# EAGLE design zook (EAGLE 7.2.0)
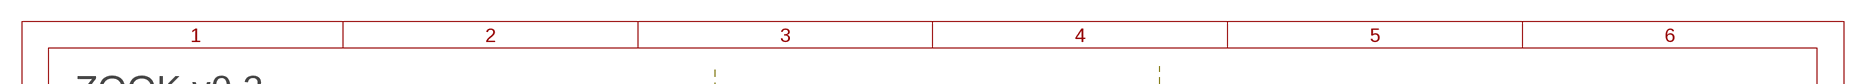
[diagram p0: schematic, sheet 1, part 1 of 2]
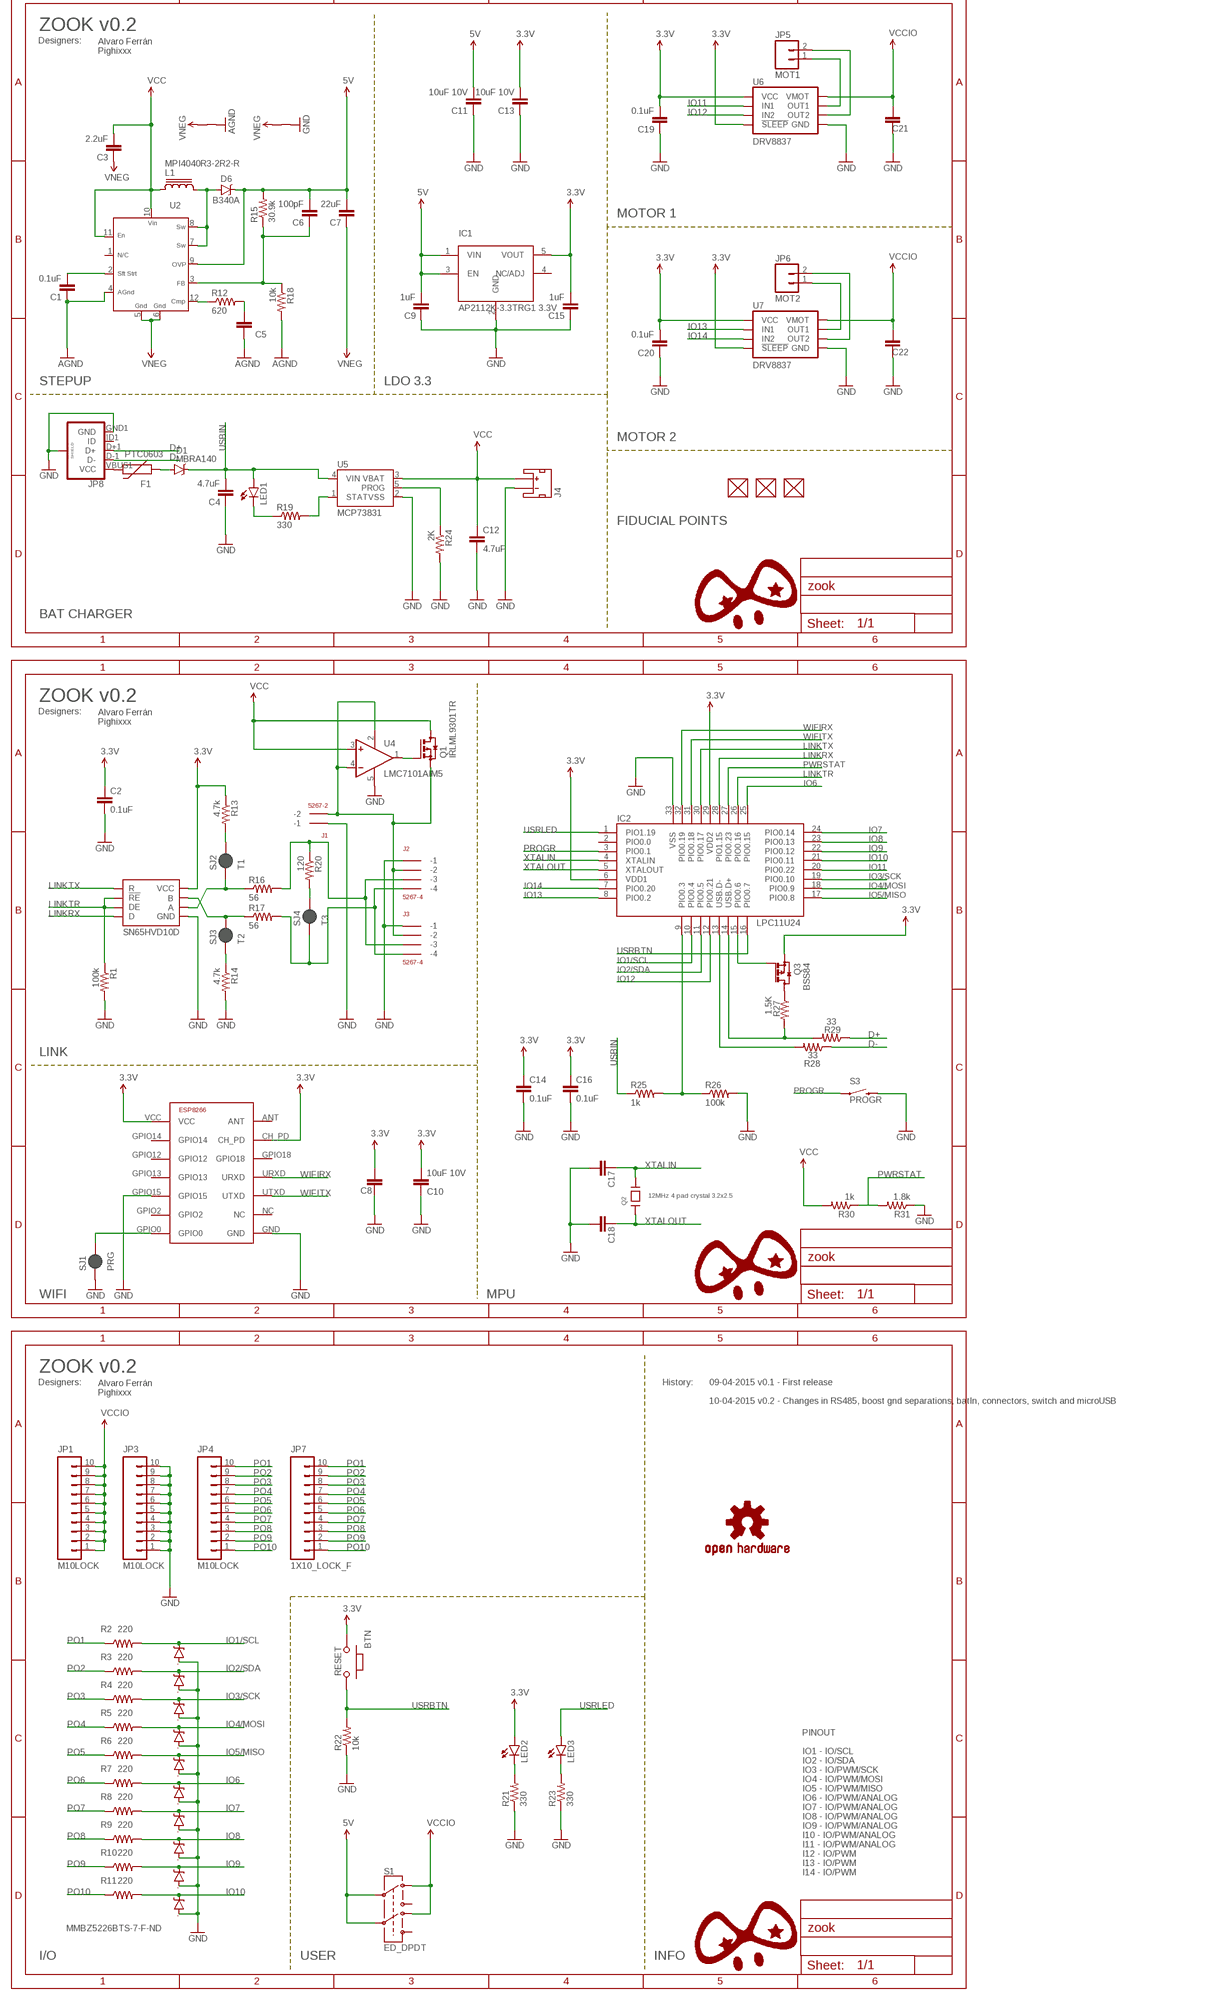
[diagram p1: schematic, sheet 1, part 2 of 2]

## Parts
BTN  RESET  PB157  [157SW]
C1  0.1uF  CAP0402-CAP  [0402-CAP]
C2  0.1uF  CAP0402-CAP  [0402-CAP]
C3  2.2uF  CAP0402-CAP  [0402-CAP]
C4  4.7uF  CAP0402-CAP  [0402-CAP]
C5  10nF  CAP0402-CAP  [0402-CAP]
C6  100pF  CAP0402-CAP  [0402-CAP]
C7  22uF  22UF-6.3V-20%(0805)  [0805]
C8  0.1uF  CAP0402-CAP  [0402-CAP]
C9  1uF  CAP0402-CAP  [0402-CAP]
C10  10uF 10V  CAP0402-CAP  [0402-CAP]
C11  10uF 10V  CAP0402-CAP  [0402-CAP]
C12  4.7uF  CAP0402-CAP  [0402-CAP]
C13  10uF 10V  CAP0402-CAP  [0402-CAP]
C14  0.1uF  CAP0402-CAP  [0402-CAP]
C15  1uF  CAP0402-CAP  [0402-CAP]
C16  0.1uF  CAP0402-CAP  [0402-CAP]
C17  27pF  CAP0402-CAP  [0402-CAP]
C18  27pF  CAP0402-CAP  [0402-CAP]
C19  0.1uF  CAP0402-CAP  [0402-CAP]
C20  0.1uF  CAP0402-CAP  [0402-CAP]
C21  0.1uF  CAP0402-CAP  [0402-CAP]
C22  0.1uF  CAP0402-CAP  [0402-CAP]
D1  MBRA140  [SMA-DIODE]
D2  ZENERARRAY  [SOT363]
D3  ZENERARRAY  [SOT363]
D4  ZENERARRAY  [SOT363]
D5  ZENERARRAY  [SOT363]
D6  B340A  DIODE-SCHOTTKY-B340A  [SMA-DIODE]
F1  PTC0603  [0603]
FUD1  FIDUCIAL  [FIDUCIAL_40MIL]
FUD2  FIDUCIAL  [FIDUCIAL_40MIL]
FUD3  FIDUCIAL  [FIDUCIAL_40MIL]
GND5  VIRTUAL_GND  [STARGND]
GND6  VIRTUAL_GND  [STARGND]
IC1  AP2112K-3.3TRG1 3.3V  5PIN_REG  [SOT23-5]
IC2  LPC11U24  LPC11U2X_HVQFN33(5X5)  [HVQFN33_5X5MM]
J1  5267-2  [5267-2]
J2  5267-4  [5267-4]
J3  5267-4  [5267-4]
J4  BATT  JST_2MM_MALE  [JST-2-SMD]
JP1  M10LOCK  [1X10_LOCK]
JP3  M10LOCK  [1X10_LOCK]
JP4  M10LOCK  [1X10_LOCK]
JP5  MOT1  M02POLAR  [MOLEX-1X2]
JP6  MOT2  M02POLAR  [MOLEX-1X2]
JP7  1X10_LOCK_F  [1X10_LOCK_F]
JP8  USB_MICROB_PLUGCONN-11752  [USB-B-MICRO-SMD_V03]
L1  MPI4040R3-2R2-R  [MPI4040R3-2R2-R]
LED1  LED0603  [LED-0603]
LED2  LED0603  [LED-0603]
LED3  LED0603  [LED-0603]
LOGO3  OSHW-LOGOS  [OSHW-LOGO-S]
Q1  IRLML9301TR  BSS84  [SOT23]
Q2  12MHz 4 pad crystal 3.2x2.5  CRYSTAL3.2X2.5  [CRYSTAL_3.2X2.5]
Q3  BSS84  [SOT23]
R1  100k  RESISTOR0402-RES  [0402-RES]
R2  220  220KOHM1/10W1%(0603)  [0603-RES]
R3  220  220KOHM1/10W1%(0603)  [0603-RES]
R4  220  220KOHM1/10W1%(0603)  [0603-RES]
R5  220  220KOHM1/10W1%(0603)  [0603-RES]
R6  220  220KOHM1/10W1%(0603)  [0603-RES]
R7  220  220KOHM1/10W1%(0603)  [0603-RES]
R8  220  220KOHM1/10W1%(0603)  [0603-RES]
R9  220  220KOHM1/10W1%(0603)  [0603-RES]
R10  220  220KOHM1/10W1%(0603)  [0603-RES]
R11  220  220KOHM1/10W1%(0603)  [0603-RES]
R12  620  RESISTOR0402-RES  [0402-RES]
R13  4.7k  RESISTOR0402-RES  [0402-RES]
R14  4.7k  RESISTOR0402-RES  [0402-RES]
R15  30.9k  RESISTOR0402-RES  [0402-RES]
R16  56  RESISTOR0402-RES  [0402-RES]
R17  56  RESISTOR0402-RES  [0402-RES]
R18  10k  RESISTOR0402-RES  [0402-RES]
R19  330  RESISTOR0402-RES  [0402-RES]
R20  120  RESISTOR0402-RES  [0402-RES]
R21  330  RESISTOR0402-RES  [0402-RES]
R22  10k  RESISTOR0402-RES  [0402-RES]
R23  330  RESISTOR0402-RES  [0402-RES]
R24  2K  RESISTOR0402-RES  [0402-RES]
R25  1k  RESISTOR0402-RES  [0402-RES]
R26  100k  RESISTOR0402-RES  [0402-RES]
R27  1.5K  RESISTOR0402-RES  [0402-RES]
R28  33  RESISTOR0402-RES  [0402-RES]
R29  33  RESISTOR0402-RES  [0402-RES]
R30  1k  RESISTOR0402-RES  [0402-RES]
R31  1.8k  RESISTOR0402-RES  [0402-RES]
S1  ED_DPDT  [ED_DPDT]
S3  PROGR  SWITCH-MOMENTARY-2SIDE_EZ  [TACTILE-PTH-SIDEEZ]
SJ1  PRG  JUMPER-PAD-2-NC_BY_PASTE  [PAD-JUMPER-2-NC_BY_PASTE_YES_SILK]
SJ2  T1  JUMPER-PAD-2-NC_BY_PASTE  [PAD-JUMPER-2-NC_BY_PASTE_YES_SILK]
SJ3  T2  JUMPER-PAD-2-NC_BY_PASTE  [PAD-JUMPER-2-NC_BY_PASTE_YES_SILK]
SJ4  T3  JUMPER-PAD-2-NC_BY_PASTE  [PAD-JUMPER-2-NC_BY_PASTE_YES_SILK]
U2  MIC2253  [MLF12_3.0MM_X_3.0MM]
U3  ESP8266  [ESP-03]
U4  LMC7101AIM5  [SOT23-5]
U5  MCP73831  [SOT23-5]
U6  DRV8837  [DSG]
U7  DRV8837  [DSG]
U8  SN65HVD10D  [SO08]

## Nets
3.3V: BTN.1 C2.1 C8.2 C10.2 C13.2 C14.1 C15.2 C16.1 C19.2 C20.2 IC1.5(VOUT) IC2.6(VDD1) IC2.29(VDD2) LED2.A Q3.2(S) R13.1 U3.CH_PD U3.VCC U6.7(!SLEEP) U6.8(VCC) U7.7(!SLEEP) U7.8(VCC) U8.8
5V: C6.2 C7.2 C9.2 C11.2 D6.C IC1.1(VIN) IC1.3(EN) R15.2 S1.2 S1.5 U2.9(OVP)
AGND: C1.1 C5.1 GND5.P$2 R18.2 U2.4(AGND)
D+: JP8.D+1(D+) R29.1
D-: JP8.D-1(D-) R28.1
GND: C2.2 C4.1 C8.1 C9.1 C10.1 C11.1 C12.2 C13.1 C14.2 C15.1 C16.2 C17.2 C18.2 C19.1 C20.1 C21.1 C22.1 D2.1(A) D2.2(A) D2.3(A) D3.1(A) D3.2(A) D3.3(A) D4.1(A) D4.2(A) D4.3(A) D5.1(A) GND6.P$2 IC1.2(GND) IC2.33(VSS) J1.P$1(-1) J2.P$1(-1) J3.P$1(-1) J4.1(-) JP3.1 JP3.2 JP3.3 JP3.4 JP3.5 JP3.6 JP3.7 JP3.8 JP3.9 JP3.10 JP8.GND1(GND) JP8.SHIELD1(SHIELD) JP8.SHIELD2(SHIELD) JP8.SHIELD3(SHIELD) R1.2 R14.2 R21.1 R22.1 R23.1 R24.2 R26.2 R31.1 S3.2 SJ1.1 U3.GND U3.GPIO15 U4.5(V-) U5.2(VSS) U6.4(GND) U6.PAD(GND) U7.4(GND) U7.PAD(GND) U8.5
IO1/SCL: D2.6(C) IC2.10(PIO0.4) R2.2
IO2/SDA: D2.5(C) IC2.11(PIO0.5) R3.2
IO3/SCK: D2.4(C) IC2.19(PIO0.10) R4.2
IO4/MOSI: D3.6(C) IC2.18(PIO0.9) R5.2
IO5/MISO: D3.5(C) IC2.17(PIO0.8) R6.2
IO6: D3.4(C) IC2.25(PIO0.15) R7.2
IO7: D4.6(C) IC2.24(PIO0.14) R8.2
IO8: D4.5(C) IC2.23(PIO0.13) R9.2
IO9: D4.4(C) IC2.22(PIO0.12) R10.2
IO10: D5.6(C) IC2.21(PIO0.11) R11.2
IO11: IC2.20(PIO0.22) U6.6(IN1)
IO12: IC2.12(PIO0.21) U6.5(IN2)
IO13: IC2.8(PIO0.2) U7.6(IN1)
IO14: IC2.7(PIO0.20) U7.5(IN2)
LINKRX: IC2.28(PIO1.15) U8.4
LINKTR: IC2.26(PIO0.16) R1.1 U8.2 U8.3
LINKTX: IC2.30(PIO0.17) U8.1
N$1: J2.P$4(-4) J3.P$4(-4) R17.2 SJ4.1
N$2: LED2.C R21.2
N$3: C5.2 R12.2
N$4: D6.A L1.P$2 U2.7(SW) U2.8(SW)
N$6: C1.2 U2.2(SS)
N$7: F1.2 JP8.VBUS1(VCC)
N$8: R12.1 U2.12(CMP)
N$9: D1.A F1.1
N$10: JP5.1 U6.2(OUT1)
N$11: JP5.2 U6.3(OUT2)
N$12: R19.2 U5.1(STAT)
N$13: LED1.C R19.1
N$14: JP6.1 U7.2(OUT1)
N$15: JP6.2 U7.3(OUT2)
N$16: R17.1 SJ3.2 U8.7
N$17: R16.1 SJ2.1 U8.6
N$18: R13.2 SJ2.2
N$19: R20.2 SJ4.2
N$20: R14.1 SJ3.1
N$21: J2.P$3(-3) J3.P$3(-3) R16.2 R20.1
N$22: LED3.C R23.2
N$24: C6.1 R15.1 R18.1 U2.3(FB)
N$25: Q1.1(G) U4.1(OUT)
N$26: J1.P$2(-2) J2.P$2(-2) J3.P$2(-2) Q1.2(S) U4.2(V+) U4.4(-IN)
N$27: IC2.14(USB.D+) R27.2 R29.2
N$28: SJ1.2 U3.GPIO0
N$29: IC2.13(USB.D-) R28.2
N$30: Q3.3(D) R27.1
N$31: IC2.15(PIO0.6) Q3.1(G)
P0.3/ISP_COMMAND_USB_HIGH: IC2.9(PIO0.3) R25.2 R26.1
PO1: JP4.10 JP7.10 R2.1
PO2: JP4.9 JP7.9 R3.1
PO3: JP4.8 JP7.8 R4.1
PO4: JP4.7 JP7.7 R5.1
PO5: JP4.6 JP7.6 R6.1
PO6: JP4.5 JP7.5 R7.1
PO7: JP4.4 JP7.4 R8.1
PO8: JP4.3 JP7.3 R9.1
PO9: JP4.2 JP7.2 R10.1
PO10: JP4.1 JP7.1 R11.1
PROG: R24.1 U5.5(PROG)
PROGR: IC2.3(PIO0.1) S3.1
PWRSTAT: IC2.27(PIO0.23) R30.1 R31.2
USBIN: C4.2 D1.C LED1.A R25.1 U5.4(VIN)
USRBTN: BTN.2 IC2.16(PIO0.7) R22.2
USRLED: IC2.1(PIO1.19) LED3.A
VCC: C3.2 C12.1 J4.2(+) L1.P$1 Q1.3(D) R30.2 U2.10(VIN) U2.11(EN) U4.3(+IN) U5.3(VBAT)
VCCIO: C21.2 C22.2 JP1.1 JP1.2 JP1.3 JP1.4 JP1.5 JP1.6 JP1.7 JP1.8 JP1.9 JP1.10 S1.1 S1.4 U6.1(VMOT) U7.1(VMOT)
VNEG: C3.1 C7.1 GND5.P$1 GND6.P$1 U2.5(GND) U2.6(GND)
WIFIRX: IC2.32(PIO0.19) U3.URXD
WIFITX: IC2.31(PIO0.18) U3.UTXD
XTALIN: C17.1 IC2.4(XTALIN) Q2.3
XTALOUT: C18.1 IC2.5(XTALOUT) Q2.1
Unconnected: D5.2(A) D5.3(A) D5.4(C) D5.5(C) FUD1.P$1 FUD2.P$1 FUD3.P$1 IC1.4(NC/ADJ) IC2.2(PIO0.0) J4.NC1(PAD1) J4.NC2(PAD2) JP8.ID1(ID) S1.3 S1.6 U2.1(NC) U3.ANT U3.GPIO2 U3.GPIO12 U3.GPIO13 U3.GPIO14 U3.GPIO18 U3.NC

## Notes on the sheet
- ZOOK v0.2
- Designers: | Alvaro Ferrán
- Pighixxx
- MOTOR 1
- STEPUP | LDO 3.3
- MOTOR 2
- FIDUCIAL POINTS
- BAT CHARGER
- ZOOK v0.2
- Designers: | Alvaro Ferrán
- Pighixxx
- LINK
- WIFI | MPU
- ZOOK v0.2
- Designers: | Alvaro Ferrán | History: | 09-04-2015 v0.1 - First release
- Pighixxx
- 10-04-2015 v0.2 - Changes in RS485, boost gnd separations, batIn, connectors, switch and microUSB
- PINOUT
- IO1 - IO/SCL
- IO2 - IO/SDA
- IO3 - IO/PWM/SCK
- IO4 - IO/PWM/MOSI
- IO5 - IO/PWM/MISO
- IO6 - IO/PWM/ANALOG
- IO7 - IO/PWM/ANALOG
- IO8 - IO/PWM/ANALOG
- IO9 - IO/PWM/ANALOG
- I10 - IO/PWM/ANALOG
- I11 - IO/PWM/ANALOG
- I12 - IO/PWM
- I13 - IO/PWM
- I14 - IO/PWM
- MMBZ5226BTS-7-F-ND
- I/O | USER | INFO

## Library data of the parts
BTN = MySMD:PB157
C1-C6 C8-C22 = SparkFun-Passives:CAP: Capacitor Standard 0603 ceramic capacitor, and 0.1" leaded capacitor.
C7 = SparkFun-Capacitors:22UF-6.3V-20%(0805): CAP-08402 Ceramic; PROD_ID: CAP-08402
D1 = SparkFun-DiscreteSemi:MBRA140: 40V, 1A Schottky rectifier SMA/DO-214AC package DIO-08053; PROD_ID: DIO-08053
D2-D5 = Diode-Array:ZENERARRAY
D6 = SparkFun-DiscreteSemi:DIODE-SCHOTTKY: Schottky diodes in SFE's production catalog BAT20J 1A 23V 0.62Vf RB751 120mA 40V 0.37Vf PMEG4005EJ 0.5A 40V 0.42Vf MBRA140 1A 40V 0.5Vf B340A 3A 40V SMA; PROD_ID: DIO-09886
F1 = SparkFun-PowerIC:PTC: Resettable Fuse PTC Resettable Fuse. Spark Fun Electronics SKU : COM-08357
FUD1-FUD3 = GHI:FIDUCIAL
GND5 GND6 = alvaroferran:VIRTUAL_GND
IC1 = GHI:5PIN_REG
IC2 = GHI-SoMs-Processors:LPC11U2X_HVQFN33(5X5)
J1 = con-molex-spox:5267-2
J2 J3 = con-molex-spox:5267-4
J4 = SparkFun-Connectors:JST_2MM_MALE: Mates to single-cell LiPo batteries. CONN-08352; PROD_ID: CONN-08352
JP1 JP3 JP4 = SparkFun-Connectors:M10: Header 10 Standard 10-pin 0.1" header. Use with straight break away headers (SKU : PRT-00116), right angle break away headers (PRT-00553), swiss pins (PRT-00743), machine pins (PRT-00117), and female headers (PRT-00115).
JP5 JP6 = SparkFun-Connectors:M02: Standard 2-pin 0.1" header. Use with - straight break away headers ( PRT-00116) - right angle break away headers (PRT-00553) - swiss pins (PRT-00743) - machine pins (PRT-00117) - female headers (PRT-00115) Molex polarized connector foot print use with: PRT-08233 with associated crimp pins and housings. 2.54_SCREWTERM for use with PRT-10571. 3.5mm Screw Terminal footprints for PRT-08084 5mm Screw Terminal footprints for use with PRT-08432
JP7 = pighiXXX:1X10_LOCK_F
JP8 = SparkFun-Connectors:USB_MICROB_PLUG: USB Micro-B connectors Some male, some female. Watch your step!; PROD_ID: CONN-11752
L1 = inductor-Eaton Bussmann:MPI4040R3-2R2-R
LED1-LED3 = SparkFun-LED:LED: LEDs Standard schematic elements and footprints for 5mm, 3mm, 1206, and 0603 sized LEDs. 5mm - Spark Fun Electronics SKU : COM-00529 (and others)
LOGO3 = SparkFun-Aesthetics:OSHW-LOGO: Open Source Hardware Logo This logo indicates the piece of hardware it is found on incorporates a OSHW license and/or adheres to the definition of open source hardware found here: http://freedomdefined.org/OSHW
Q1 Q3 = transistor-small-signal:BSS84: P-CHANNEL MOS FET
Q2 = GHI:CRYSTAL3.2X2.5
R1 R12-R31 = SparkFun-Passives:RESISTOR: Resistor Basic schematic elements and footprints for 0603, 1206, and PTH resistors.
R2-R11 = SparkFun-Resistors:220KOHM1/10W1%(0603): RES-08969; PROD_ID: RES-08969; VALUE: 220k
S1 = pighiXXX:ED_DPDT
S3 = SparkFun-Electromechanical:SWITCH-MOMENTARY-2: Various NO switches- pushbuttons, reed, etc
SJ1-SJ4 = SparkFun-Passives:JUMPER-PAD-2-NC_BY_PASTE
U2 = MIC2253_MLF12:MIC2253: MIC2253 - 3.5A, 1 MHz High Efficiency, Variable Voltage Inuput Boost Regulator with Over Voltage Protection and Soft-Start, Micrel 02-13-2013 - troneeee@gmail.com
U3 = ESP8266:ESP8266: low cost Wifi to Serial Module
U4 = linear:LMC7101AIM5
U5 = SparkFun-PowerIC:MCP73831: Miniature single cell, fully integrated Li-Ion, Li-polymer charge management controller http://ww1.microchip.com/downloads/en/DeviceDoc/21984a.pdf IC-09995; PROD_ID: IC-09995
U6 U7 = packages(ti):DRV8837
U8 = pighiXXX:SN65HVD10D: 3.3-V RS-485 TRANSCEIVER

## Net classes
0 default: width 0.254 mm, drill 0.254 mm, clearance 0.203 mm

## Board
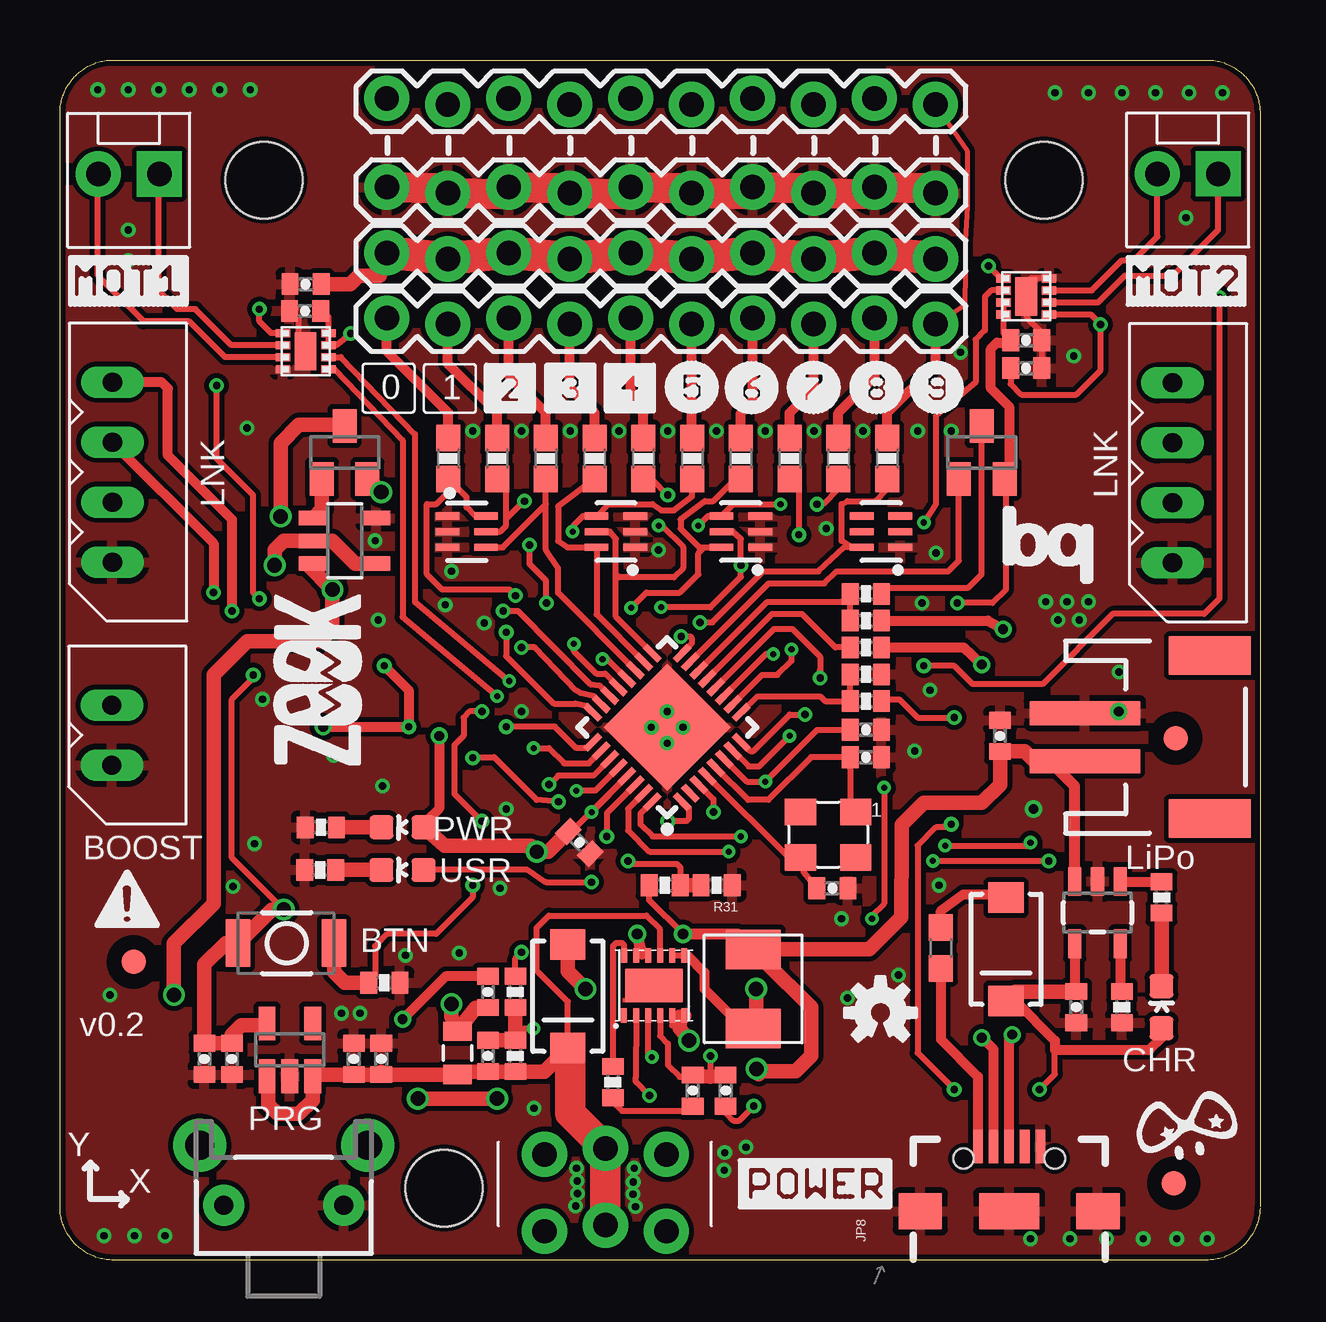
[diagram p2: board, top side]
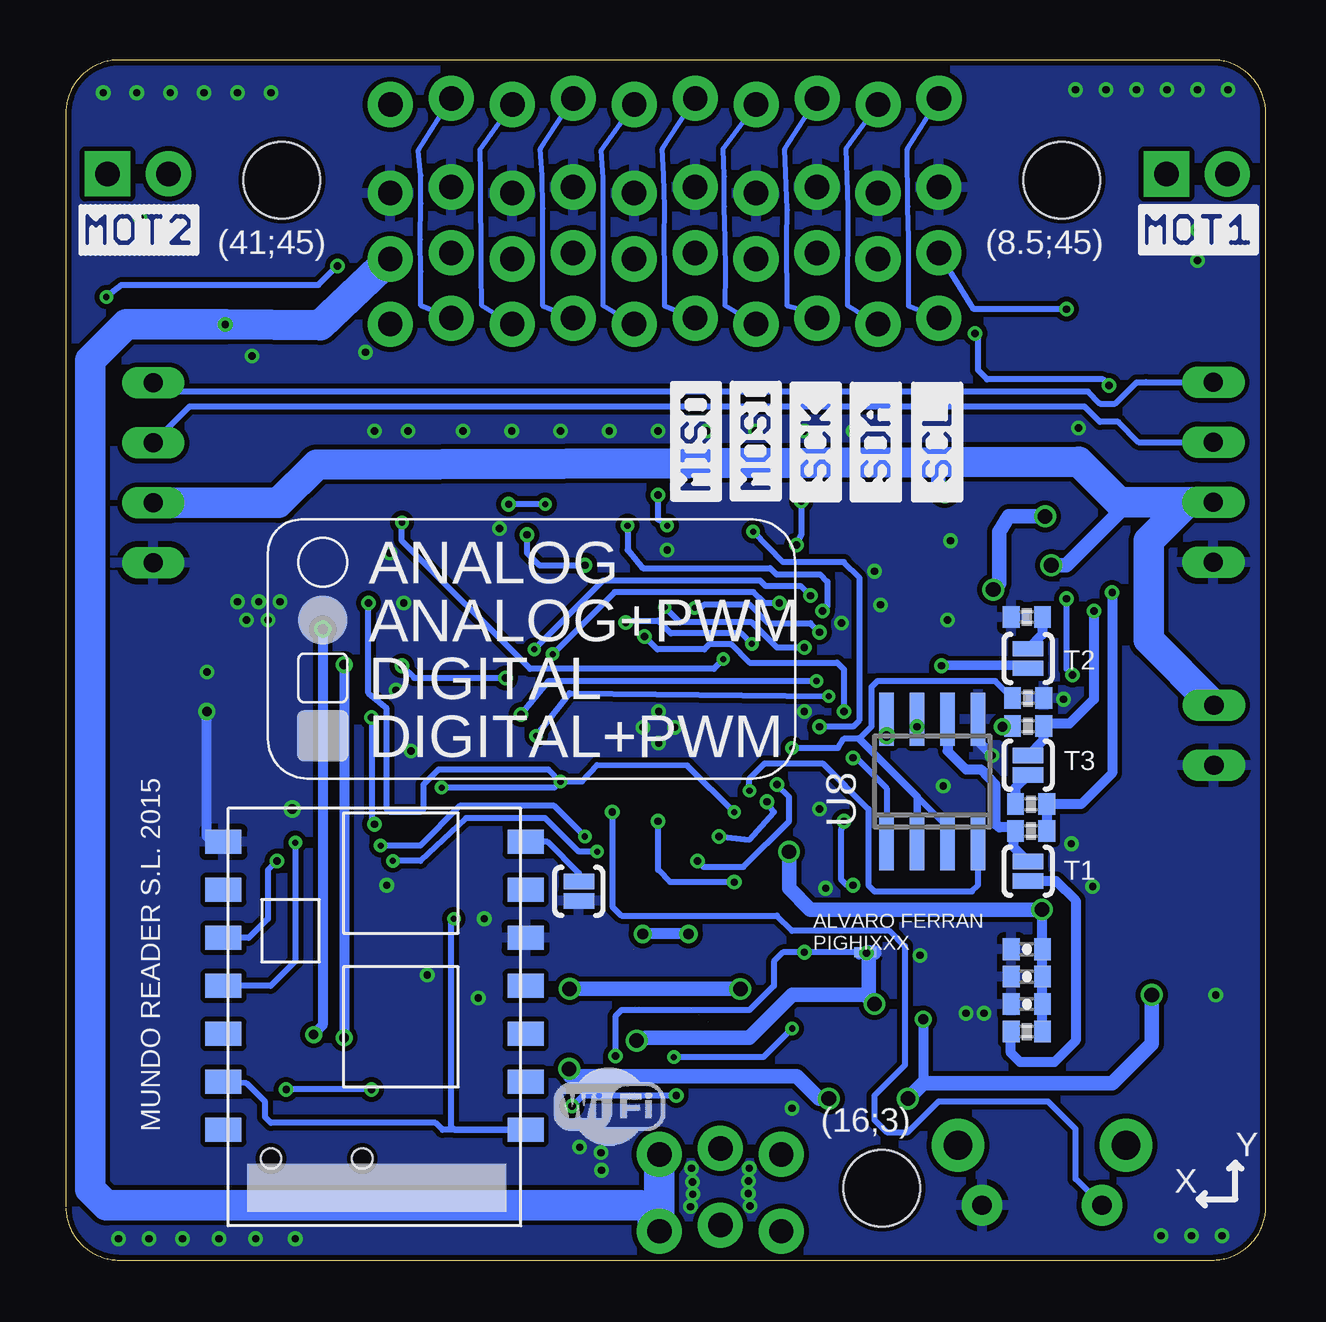
[diagram p3: board, bottom side, seen from below]

Size 50 x 50 mm. Coordinates in mm from the lower left corner, seen from the top.
Outline: 50,2.15 50,2.07 49.99,2 49.98,1.92 49.97,1.85 49.95,1.78 49.94,1.7 49.92,1.63 49.9,1.56 49.88,1.49 49.85,1.43 49.83,1.36 49.8,1.29 49.77,1.23 49.7,1.1 49.66,1.04 49.62,0.98 49.58,0.92 49.54,0.87 49.49,0.81 49.45,0.76 49.4,0.7 49.3,0.6 49.24,0.55 49.19,0.51 49.13,0.46 49.08,0.42 49.02,0.38 48.96,0.34 48.9,0.3 48.77,0.24 48.71,0.2 48.64,0.18 48.57,0.15 48.51,0.12 48.37,0.08 48.3,0.06 48.22,0.05 48.15,0.03 48.08,0.02 47.93,0 47.85,0 2.15,0 2.07,0 1.92,0.02 1.85,0.03 1.78,0.05 1.7,0.06 1.63,0.08 1.49,0.12 1.43,0.15 1.36,0.18 1.29,0.2 1.23,0.24 1.17,0.27 1.1,0.3 1.04,0.34 0.98,0.38 0.92,0.42 0.87,0.46 0.81,0.51 0.76,0.55 0.7,0.6 0.6,0.7 0.55,0.76 0.51,0.81 0.46,0.87 0.42,0.92 0.38,0.98 0.34,1.04 0.3,1.1 0.23,1.23 0.2,1.29 0.17,1.36 0.15,1.43 0.12,1.49 0.1,1.56 0.08,1.63 0.06,1.7 0.04,1.78 0.03,1.85 0.02,1.92 0.01,2 0,2.07 0,2.15 0,47.85 0,47.93 0.01,48 0.02,48.08 0.03,48.15 0.04,48.22 0.06,48.3 0.08,48.37 0.1,48.44 0.12,48.51 0.15,48.57 0.17,48.64 0.2,48.71 0.23,48.77 0.27,48.83 0.3,48.9 0.34,48.96 0.38,49.02 0.42,49.08 0.46,49.13 0.51,49.19 0.55,49.24 0.6,49.3 0.65,49.35 0.7,49.4 0.76,49.45 0.81,49.49 0.87,49.54 0.92,49.58 0.98,49.62 1.04,49.66 1.1,49.7 1.17,49.73 1.23,49.77 1.29,49.8 1.36,49.82 1.43,49.85 1.49,49.88 1.63,49.92 1.7,49.94 1.78,49.95 1.85,49.97 1.92,49.98 2.07,50 2.15,50 47.85,50 47.93,50 48.08,49.98 48.15,49.97 48.22,49.95 48.3,49.94 48.37,49.92 48.51,49.88 48.57,49.85 48.64,49.82 48.71,49.8 48.77,49.77 48.9,49.7 48.96,49.66 49.02,49.62 49.08,49.58 49.13,49.54 49.19,49.49 49.24,49.45 49.3,49.4 49.35,49.35 49.4,49.3 49.45,49.24 49.49,49.19 49.54,49.13 49.58,49.08 49.62,49.02 49.66,48.96 49.7,48.9 49.73,48.83 49.77,48.77 49.8,48.71 49.85,48.57 49.88,48.51 49.92,48.37 49.94,48.3 49.95,48.22 49.97,48.15 49.98,48.08 49.99,48 50,47.93 50,47.85 50,2.22
Copper layers (1*16): Top 0.035mm / dielectric 1.5mm / Bottom 0.035mm
Design rules "pighixxx_CAM_DRC_V1.0 *": minimum track width 6mil, minimum drill 12mil, track to track 6mil, track to pad 6mil, pad to pad 6mil, via to via 6mil, smd to smd 0mil, copper to edge 8mil, drill to drill 8mil, minimum pad ring 10mil, minimum via ring 6mil, stop-mask expansion 2mil, vias tented up to drill 100mil, thermal gap 10mil
Holes 3.2 mm at 8.5,44.99 41,44.99 16,2.99

### Footprints (pad centres in the part's own frame; a part is rotated, then mirrored left to right if it is on the bottom)
157SW = smd 1.016 x 1.981: 1 0,0; 2 4,0
0402-CAP = smd 0.7 x 0.9: 1 -0.65,0; 2 0.65,0
0805 = smd 0.8 x 1.2: 1 -0.9,0; 2 0.9,0
SMA-DIODE = smd 1.27 x 1.47: A -2.15,0; C 2.15,0
SOT363 = smd 0.3 x 0.99: 1 0.62,0.47; 2 1.27,0.47; 3 1.92,0.47; 4 1.92,2.08; 5 1.27,2.08; 6 0.62,2.08
0603 = smd 1.1 x 1: 1 -0.85,0; 2 0.85,0
FIDUCIAL_40MIL = smd 1.016 x 1.016: P$1 0,0
STARGND = smd 0.203 x 0.406: P$1 -0.102,0; P$2 0.102,0
SOT23-5 = smd 0.7 x 1.4: 1 0.95,1.1; 2 0,1.1; 3 -0.95,1.1; 4 -0.95,-1.1; 5 0.95,-1.1
HVQFN33_5X5MM = smd 0.85 x 0.27: 1 -2.625,1.75; 2 -2.625,1.25; 3 -2.625,0.75; 4 -2.625,0.25; 5 -2.625,-0.25; 6 -2.625,-0.75; 7 -2.625,-1.25; 8 -2.625,-1.75; 17 2.625,-1.75; 18 2.625,-1.25; 19 2.625,-0.75; 20 2.625,-0.25; 21 2.625,0.25; 22 2.625,0.75; 23 2.625,1.25; 24 2.625,1.75 | smd 0.27 x 0.85: 9 -1.75,-2.625; 10 -1.25,-2.625; 11 -0.75,-2.625; 12 -0.25,-2.625; 13 0.25,-2.625; 14 0.75,-2.625; 15 1.25,-2.625; 16 1.75,-2.625; 25 1.75,2.625; 26 1.25,2.625; 27 0.75,2.625; 28 0.25,2.625; 29 -0.25,2.625; 30 -0.75,2.625; 31 -1.25,2.625; 32 -1.75,2.625 | smd 3.75 x 3.75: 33 0,0
5267-2 = drill 0.8 long: P$1 0,0; P$2 2.5,0
5267-4 = drill 0.8 long: P$1 0,0; P$2 2.5,0; P$3 5,0; P$4 7.5,0
JST-2-SMD = smd 1 x 4.6: 1 -1,-3.7; 2 1,-3.7 | smd 1.6 x 3.4: NC1 -3.4,1.5; NC2 3.4,1.5
1X10_LOCK = drill 1.016 pad 1.88: 1 0,0.127; 2 2.54,-0.127; 3 5.08,0.127; 4 7.62,-0.127; 5 10.16,0.127; 6 12.7,-0.127; 7 15.24,0.127; 8 17.78,-0.127; 9 20.32,0.127; 10 22.86,-0.127
MOLEX-1X2 = drill 1.016 pad 1.88 square: 1 0,0 | drill 1.016 pad 1.88: 2 2.54,0
1X10_LOCK_F = drill 1.016 pad 1.88: 1 -22.86,0.127; 2 -20.32,-0.127; 3 -17.78,0.127; 4 -15.24,-0.127; 5 -12.7,0.127; 6 -10.16,-0.127; 7 -7.62,0.127; 8 -5.08,-0.127; 9 -2.54,0.127; 10 0,-0.127
USB-B-MICRO-SMD_V03 = smd 1.4 x 0.4: D+1 2.7,0; D-1 2.7,0.65; GND1 2.7,-1.3; ID1 2.7,-0.65; VBUS1 2.7,1.3 | smd 1.5 x 1.8: SHIELD1 0,3.7; SHIELD2 0,-3.7 | smd 1.5 x 2.5: SHIELD3 0,0 | hole 0.85: 2.2,1.9; 2.2,-1.9
MPI4040R3-2R2-R = smd 1.65 x 2.3: P$1 -1.645,0; P$2 1.645,0
LED-0603 = smd 1 x 1: A 0,-0.877; C 0,0.877
SOT23 = smd 1 x 1.4: 1 -0.95,-1.1; 2 0.95,-1.1; 3 0,1.1
CRYSTAL_3.2X2.5 = smd 1.3 x 1.1: 1 -1.1,-0.9; 2 1.2,-0.9; 3 1.2,1; 4 -1.1,1
0402-RES = smd 0.7 x 0.9: 1 -0.65,0; 2 0.65,0
0603-RES = smd 1.1 x 1: 1 -0.85,0; 2 0.85,0
ED_DPDT = drill 1.016 pad 1.88: 1 -2.54,-1.397; 2 0,-1.651; 3 2.54,-1.397; 4 -2.54,1.803; 5 0,1.549; 6 2.54,1.803
TACTILE-PTH-SIDEEZ = drill 0.8 pad 1.7: 1 -2.5,0; 2 2.5,0 | drill 1.2 pad 2.2: ANCHOR1 -3.5,2.5; ANCHOR2 3.5,2.5
PAD-JUMPER-2-NC_BY_PASTE_YES_SILK = smd 0.635 x 1.27: 1 -0.401,0; 2 0.413,0
MLF12_3.0MM_X_3.0MM = smd 0.6 x 0.25: 1 -1.244,1.291; 2 -1.242,0.79; 3 -1.242,0.29; 4 -1.242,-0.21; 5 -1.242,-0.71; 6 -1.242,-1.21; 7 1.265,-1.211; 8 1.265,-0.711; 9 1.265,-0.211; 10 1.265,0.289; 11 1.265,0.789; 12 1.266,1.29 | smd 1.4 x 2.4: EXP 0.01,0.038
ESP-03 = smd 1 x 1.5: ANT 4,12.4; CH_PD 6,12.4; GND 16,12.4; GPIO0 16,-0.2; GPIO2 14,-0.2; GPIO12 8,-0.2; GPIO13 10,-0.2; GPIO14 6,-0.2; GPIO15 12,-0.2; GPIO18 8,12.4; NC 14,12.4; URXD 10,12.4; UTXD 12,12.4; VCC 4,-0.2
SOT23-5' = smd 0.6 x 1.2: 1 -0.95,-1.306; 2 0,-1.306; 3 0.95,-1.306; 4 0.95,1.306; 5 -0.95,1.306
SOT23-5'' = smd 0.55 x 1.2: 1 -0.95,-1.3; 2 0,-1.3; 3 0.95,-1.3; 4 0.95,1.3; 5 -0.95,1.3
DSG = smd 0.6 x 0.35: 1 -0.95,0.75; 2 -0.95,0.25; 3 -0.95,-0.25; 4 -0.95,-0.75; 5 0.95,-0.75; 6 0.95,-0.25; 7 0.95,0.25; 8 0.95,0.75 | smd 0.9 x 1.6: PAD 0,0
SO08 = smd 0.6 x 2.2: 1 -1.905,-2.6; 2 -0.635,-2.6; 3 0.635,-2.6; 4 1.905,-2.6; 5 1.905,2.6; 6 0.635,2.6; 7 -0.635,2.6; 8 -1.905,2.6

### Placement (x,y rotation side)
BTN  7.42,13.2 0 top
C1  27.74,7.06 270 top
C2  9.96,12.95 180 bottom
C3  17.83,11.17 90 top
C4  42.34,10.54 90 top
C5  26.37,7.06 270 top
C6  17.83,8.5 270 top
C7  16.56,8.63 270 top
C8  9.96,10.66 0 bottom
C9  12.24,8.38 270 top
C10  9.96,11.81 0 bottom
C11  13.39,8.38 270 top
C12  39.17,21.84 90 top
C13  6.02,8.38 90 top
C14  33.58,22.09 0 top
C15  7.16,8.38 90 top
C16  21.64,17.39 315 top
C17  32.18,15.49 0 top
C18  33.58,20.95 0 top
C19  40.26,38.32 180 top
C20  10.21,39.54 0 top
C21  40.26,37.16 180 top
C22  10.24,40.66 0 top
D1  39.42,12.95 270 top
D2  15.67,31.62 270 top
D3  24.43,29.08 90 top
D4  29.64,29.08 90 top
D5  35.48,29.08 90 top
D6  21.16,10.99 270 top
F1  36.7,13 270 top
FUD1  3.06,12.42 0 top
FUD2  46.41,3.19 0 top
FUD3  46.48,21.74 0 top
GND5  16.94,12.82 90 bottom
GND6  16.43,12.82 0 bottom
IC1  9.58,8.76 180 top
IC2  25.3,22.19 135 top
J1  2.16,20.62 90 top
J2  2.18,29.08 90 top
J3  46.35,29.05 90 top
J4  46.41,21.79 270 top
JP1  36.48,41.84 180 top
JP3  36.48,44.58 180 top
JP4  36.48,39.12 180 top
JP5  48.26,45.26 180 top
JP6  4.14,45.25 180 top
JP7  13.61,48.27 180 top
JP8  39.55,2.03 90 top
L1  28.88,11.3 270 top
LED1  45.9,10.54 0 top
LED2  14.27,18.03 90 top
LED3  14.27,16.25 90 top
LOGO3  34.19,10.31 0 top
Q1  11.86,33.65 0 top
Q2  32.05,17.77 180 top
Q3  38.4,33.65 0 top
R1  9.91,23.41 0 bottom
R2  16.18,33.4 270 top
R3  18.21,33.4 270 top
R4  20.24,33.4 270 top
R5  22.28,33.4 270 top
R6  24.31,33.4 270 top
R7  26.34,33.4 270 top
R8  28.37,33.4 270 top
R9  30.4,33.4 270 top
R10  32.44,33.4 270 top
R11  34.47,33.4 270 top
R12  23.04,7.41 270 top
R13  9.96,9.52 180 bottom
R14  9.96,26.79 180 bottom
R15  18.97,8.5 270 top
R16  9.78,17.88 0 bottom
R17  9.91,22.24 0 bottom
R18  18.97,11.17 90 top
R19  45.9,15.11 90 top
R20  9.78,18.99 180 bottom
R21  10.87,18.03 0 top
R22  13.51,11.55 180 top
R23  10.85,16.25 0 top
R24  44.25,10.54 270 top
R25  33.58,23.29 180 top
R26  33.58,24.4 0 top
R27  33.58,27.76 180 top
R28  33.58,25.52 180 top
R29  33.58,26.64 180 top
R30  25.2,15.62 180 top
R31  27.36,15.62 180 top
S1  22.73,3 180 top
S3  9.32,2.28 0 top
SJ1  28.63,15.36 90 bottom
SJ2  9.91,16.2 270 bottom
SJ3  9.91,25.06 270 bottom
SJ4  9.91,20.62 270 bottom
U2  24.79,11.42 90 top
U3  31.04,1.42 90 bottom
U4  LMC7101AIM5  [SOT23-5']  11.86,29.97 270 top
U5  MCP73831  [SOT23-5'']  43.23,14.47 180 top
U6  40.26,40.15 180 top
U7  10.24,37.87 0 top
U8  13.89,19.93 0 bottom
U$1  [S_1_P]  15.11,35.25 0 top
U$2  [S_2]  17.76,35.38 0 top
U$3  [S_0_P]  12.56,35.26 0 top
U$4  [S_5_R]  25.43,35.35 0 top
U$5  [S_3]  20.28,35.39 0 top
U$6  [S_4]  22.76,35.38 0 top
U$7  [S_6_R]  27.92,35.33 0 top
U$8  [S_7_R]  30.52,35.34 0 top
U$9  [S_8_R]  33.13,35.34 0 top
U$10  [S_9_R]  35.65,35.34 0 top
U$11  [S_SCL]  14.68,31.67 0 bottom
U$12  [S_SDA]  17.23,31.67 0 bottom
U$13  [S_MOSI]  22.23,31.71 0 bottom
U$14  [S_MISO]  24.72,31.7 0 bottom
U$15  [S_SCK]  19.73,31.68 0 bottom
U$16  [S_MOT1]  5.23,43.91 270 bottom
U$17  [S_MOT2]  49.37,43.9 270 bottom
U$18  [S_LEGEND]  41.71,19.93 0 bottom
U$19  [S_POWER]  28.34,4.15 270 top
U$20  [S_WIFI]  29.66,4.78 0 bottom
U$21  [S_ZOOK_LOGO]  12.62,20.57 90 top
U$22  [S_ATTENTION]  1.32,13.71 0 top
U$23  [PIGHIXXX_LOGO]  44.88,4.19 0 top
U$25  [S_MOT1]  0.43,41.78 270 top
U$26  [S_MOT2]  44.5,41.78 270 top
U$27  [BQ_LOGO_MEDIUM]  39.29,28.19 0 top

### Tracks (layer width: path | path; a pad name or v marks a point on that pad's centre or on a via)
3.3V  (via drill 0.25, 0.3, 0.41, 0.6)
  Top 0.254: C20.2 11.19,39.29 U7.8 U7.7 11.5,38.12 v12.12,38.6 | IC2.6 28.62,19.93 v29.39,19.93 31.55,22.09 C14.1 | C16.1 21.31,17.85 IC2.29 23.62,20.13 v22.15,18.66 | v34.34,19.68 34.34,14.85 33.83,14.35 v33.83,14.22 | v8.31,27.55 8.05,27.81 8.05,31.87 6.53,33.4 v6.53,36.44 | U6.7 U6.8 39.31,38.62 C19.2 | v9.32,14.6 7.16,16.76 7.16,23.36 8.05,24.25 v8.05,24.38 | Q3.2 39.42,32.48 39.42,27.93 38.86,27.38 v37.39,27.38
  Top 0.406: Q3.2 39.55,32.74 39.55,35.55 38.79,36.32 38.79,37.97 39.04,38.22 39.51,38.22 C19.2 | v15.8,21.84 15.8,18.8 15.29,18.29 LED2.A
  Top 0.61: IC1.5 8.54,9.77 7.54,9.77 7.16,9.39 C15.2 C13.2 6.02,12.31 6.91,13.2 BTN.1 8.81,14.6 v9.32,14.6 | C16.1 20.34,17.01 v19.86,17.01 19.61,17.27 16.04,17.27 LED2.A
  Bottom 0.254: v22.15,18.66 24.11,20.59 27.86,20.62 28.5,19.93 v29.39,19.93 | v34.34,19.68 29.64,19.68 v29.39,19.93 | U3.CH_PD 42.47,7.36 41.69,6.58 41.69,5.95 41.45,5.71 34.59,5.71 34.3,5.42 U3.VCC 33.79,5.42 33.96,5.58 33.96,14.09 v33.83,14.22 | v29.39,19.93 29.9,20.44 34.47,20.44 35.1,19.81 35.1,18.79 35.23,18.66 36.5,18.66 36.63,18.79 36.63,22.98 37.39,23.62 v37.39,27.38 | v8.31,27.55 8.31,24.63 v8.05,24.38 | v6.53,36.44 6.78,36.7 11.61,36.7 11.99,37.08 11.99,38.48 v12.12,38.6
  Bottom 0.406: v9.32,14.6 9.31,13.19 C2.1 C10.2 C8.2 R13.1 | v15.8,21.84 U8.8
  Bottom 0.61: v9.32,14.6 18.97,14.6 19.86,15.49 v19.86,17.01
5V
  Top 0.254: D6.C 21.16,10.76 19.86,12.06 19.86,13.84 20.37,14.35 24.43,14.35 25,13.78 U2.9
  Top 0.61: D6.C 20.17,7.85 R15.2 C6.2 16.43,7.85 C7.2 16.3,7.73 C11.2 | 13.39,7.85 C11.2 | C11.2 C9.2 10.6,7.73 IC1.3 10.53,6.66 9.96,6.09 9.07,6.09 8.69,6.47 8.69,7.6 IC1.1
  Top 1.27: D6.C 21.25,8.77 21.27,6.18 21.27,6.12 S1.2 S1.5
AGND  (via drill 0.3)
  Top 0.254: R18.2 18.97,12.57 v19.23,12.82 | v27.1,8.5 27.1,7.63 | U2.4 25,9.33 25.32,9.01 25.32,8.12 25.82,7.63 26.29,7.63 C5.1
  Top 0.61: C5.1 27.1,7.63 C1.1
  Bottom 0.254: v27.1,8.5 27.1,10.15 26.85,10.41 21.51,10.41 20.5,11.42 20.5,12.44 20.12,12.82 v19.23,12.82 17.04,12.82 GND5.P$2
D+  (via drill 0.41)
  Top 0.406: R29.1 38.66,26.64 v39.29,26.28 | JP8.D+1 39.55,9.27 v39.67,9.39
  Bottom 0.406: v39.29,26.28 39.29,9.77 v39.67,9.39
D-  (via drill 0.41)
  Top 0.406: R28.1 37.64,25.52 v38.41,24.81 | JP8.D-1 38.9,8.77 v38.41,9.27
  Bottom 0.406: v38.41,24.81 v38.41,9.27
GND  (via drill 0.3, 0.41)
  Top 0.254: 9.83,39.62 C20.1 9.96,39.22 9.96,37.89 10.21,37.89 U7.PAD | 29.19,29.71 D4.1 | U6.PAD 40.28,39.28 40.28,39.26 40.91,38.64 C19.1 C21.1 | 40.18,40.61 U6.PAD | U6.4 40.45,40.9 40.31,40.76 40.31,40.2 U6.PAD
  Top 0.406: v24.64,22.19 24.61,22.22 24.56,22.22 24.59,22.19
  Top 0.61: 24.59,22.19 IC2.33
  Top 1.27: JP3.1 36.3,44.66 JP3.2 33.76,44.4 JP3.3 31.22,44.66 JP3.4 28.68,44.4 JP3.5 26.14,44.66 JP3.6 23.6,44.4 JP3.7 21.06,44.66 JP3.8 18.52,44.4 JP3.9 15.98,44.66 JP3.10
  Bottom 0.406: U3.GND 43.84,17.42 43.87,17.39 44.12,17.65 v44.12,22.85 | v11.4,21.03 11.99,21.61 U8.5
  Bottom 0.61: v16.64,12.8 16.31,12.8 GND6.P$2
  other vias: 25.3,22.85 25.96,22.19 25.3,21.53 27.7,4.47 24.94,29.59 31.93,30.47 14.4,12.69 2.08,11.04 16.31,28.7 36.5,29.46 36.25,23.74 32.56,14.22 35.61,21.2 13.13,29.97 13.26,26.66 42.47,26.66 41.58,26.66 42.85,27.43 41.96,27.43 41.07,27.43 40.56,18.79 7.8,34.67 32.82,10.92 17.68,26.54 16.05,27.3 36.63,15.62 25.32,34.54 27.36,34.54 29.39,34.54 31.42,34.54 33.45,34.54 23.29,34.54 21.26,34.54 19.23,34.54 17.2,34.54 35.74,34.54 44.12,24.51 37.13,34.54 35.92,27.38 18.34,15.49 18.59,18.79 19.23,22.85 27.67,3.74 19.75,6.32 42.24,37.66 37.52,37.82 2.84,42.92 2.84,41.65 1.57,48.76 2.84,48.76 4.11,48.76 48.44,48.64 47.04,48.64 45.64,48.64 46.91,43.43 5.38,48.76 6.65,48.76 7.92,48.76 44.25,48.64 42.85,48.64 41.45,48.64 7.21,15.56 8.43,23.36 8.1,17.34 1.83,1.01 3.1,1.01 4.37,1.01 47.8,0.88 46.53,0.88 45.14,0.88 43.61,0.88 42.09,0.88 40.44,0.88 11.73,10.28 12.5,10.28 13.44,19.76 34.94,11.87 21.52,3.82 23.92,3.82 21.55,3.29 21.56,2.77 23.98,2.22 23.87,2.74 23.89,3.25 21.49,2.25 28.59,4.7
  pour Top: -0.92,51.68 50.72,51.68 50.6,-1.78 -0.92,-1.91
  pour Bottom: -1.19,52.06 51.33,52.19 51.45,-0.64 -1.06,-0.77
IO1/SCL  (via drill 0.25, 0.3)
  Top 0.254: 17.34,31 D2.6 17.31,31 16.94,31.36 16.94,31.78 R2.2 16.18,32 15.67,31.49 15.29,31.49 15.29,28.57 15.93,27.93 18.72,27.93 v18.97,27.68 | v30.48,25.45 30.48,24.96 29.9,24.38 29.25,24.38 IC2.10
  Bottom 0.254: v30.48,25.45 27.61,28.32 21.08,28.32 20.85,28.09 19.38,28.09 v18.97,27.68
IO2/SDA  (via drill 0.25, 0.3)
  Top 0.254: D2.5 18.34,30.35 18.59,30.6 18.59,30.88 | 18.59,30.88 18.59,32.16 R3.2 | IC2.11 29.41,25.24 v29.72,25.24 | v20.27,27.38 20.24,27.4 20.24,28.32 19.56,29 v19.56,29.79 | v19.36,31.62 19.33,31.62 18.59,30.88
  Bottom 0.254: v19.36,31.62 19.36,30.22 v19.56,29.79 | v20.27,27.38 20.88,27.38 21.34,27.83 27.13,27.83 v29.72,25.24
IO3/SCK
  Top 0.254: IC2.19 20.75,27.8 20.75,28.82 20.24,29.59 20.24,31.49 | 20.24,31.49 R4.2 | D2.4 18.45,29.7 20.24,31.49
IO4/MOSI
  Top 0.254: R5.2 20.75,31.4 20.75,29.97 21.15,29.7 D3.6 22.36,26.91 IC2.18
IO5/MISO  (via drill 0.25, 0.3)
  Top 0.254: IC2.17 23.16,26.8 23.16,28.57 | R6.2 24.65,32.55 v25.32,31.87 | v24.94,30.6 25.07,30.6 25.96,29.71 25.96,28.82 25.58,28.44 23.29,28.44 23.16,28.57 | 23.16,28.57 23.16,30.04 22.91,30.35 D3.5
  Bottom 0.254: v24.94,30.6 25.32,30.86 v25.32,31.87
IO6  (via drill 0.25, 0.3)
  Top 0.254: R7.2 26.34,31.82 25.58,31.24 25.07,31.24 24.69,31.49 22.85,31.49 D3.4 21.78,31 21.39,30.6 v21.36,30.35 | IC2.25 21.96,21.33 21.51,21.33 20.62,22.22 v18.59,22.22
  Bottom 0.254: v18.59,22.22 17.2,22.22 16.94,22.47 16.94,28.44 17.58,29.08 20.12,29.08 v21.36,30.35
IO7  (via drill 0.25, 0.3)
  Top 0.254: 26.85,29.7 26.63,29.7 25.86,30.47 25.86,30.86 26.87,31.62 27.23,31.62 28.16,32.55 R8.2 | 26.85,29.7 D4.6 | v23.8,27.17 24.43,27.81 25.83,27.81 26.59,28.57 26.59,29.44 26.85,29.7 | IC2.24 21.95,23.07 21.95,23.08 21.49,23.18 20.57,23.18 18.59,25.17 v18.59,26.16
  Bottom 0.254: v18.59,26.16 18.97,26.54 20.73,26.54 21.49,27.3 23.42,27.3 23.55,27.17 v23.8,27.17
IO8  (via drill 0.25, 0.3)
  Top 0.254: v25.04,27.2 27.1,27.2 28.37,28.47 v28.37,28.95 28.37,30.04 28.04,30.35 D4.5 | R9.2 30.79,32.16 v30.79,30.22 | IC2.23 22.3,23.41 22.3,23.44 22.25,23.49 21.69,23.62 21.49,23.74 19.79,25.52 v19.23,25.52
  Bottom 0.254: v28.37,28.95 30.28,28.95 30.79,29.46 v30.79,30.22 | v19.23,25.52 20.37,25.52 21.41,26.56 24.41,26.56 v25.04,27.2
IO9  (via drill 0.25, 0.3)
  Top 0.254: R10.2 32.44,32.13 31.8,31.49 v31.55,31.49 | v30.02,31.49 28.05,31.49 D4.4 26.99,31 v26.59,30.6 | v18.47,27.05 19.07,27.05 22.1,24 22.48,23.95 IC2.22
  Bottom 0.254: v30.02,31.49 v31.55,31.49 | v26.59,30.6 26.59,29.59 25.96,28.82 20.65,28.82 20.4,28.57 18.57,28.57 18.26,28.26 18.26,27.25 v18.47,27.05
IO10  (via drill 0.25, 0.3)
  Top 0.254: IC2.21 22.71,24.43 22.35,24.43 21.41,25.37 v21.41,25.67 | v26.67,26.56 27.18,26.56 29.31,28.7 31.6,28.7 32.67,29.7 D5.6 32.96,29.7 32.56,29.97 32.56,31.49 32.82,31.62 33.96,31.62 34.47,32.13 R11.2
  Bottom 0.254: v26.67,26.56 26.54,26.64 25.32,26.64 24.79,26.11 21.84,26.11 v21.41,25.67
IO11  (via drill 0.25)
  Top 0.254: v35.99,30.73 36.5,31.49 36.5,35.17 38.15,36.57 38.15,38.35 38.53,38.73 38.53,40.13 38.81,40.4 U6.6 | IC2.20 22.81,25.04 v22.61,25.04
  Bottom 0.254: v35.99,30.73 35.99,29.97 30.66,24.63 22.99,24.63 22.99,24.66 v22.61,25.04
IO12  (via drill 0.25, 0.3)
  Top 0.254: v35.99,24.76 37.26,24.76 38.02,24 40.95,24 43.87,26.92 47.68,26.92 48.31,27.55 v48.31,40.13 | 31.67,24.61 v31.67,24.25 31.67,25.14 30.53,26.28 29.74,26.28 IC2.12 | U6.5 39.2,40.9 v38.68,41.42
  Bottom 0.254: v48.31,40.13 47.68,40.63 39.47,40.63 v38.68,41.42 | v35.99,24.76 35.48,24.25 v31.67,24.25
IO13  (via drill 0.25, 0.3)
  Top 0.254: U7.6 11.71,37.62 14.78,34.41 14.78,27.43 v18.72,24.12 | IC2.8 28.76,21.2 28.88,21.2 30.4,22.73 v31.04,22.73
  Bottom 0.254: v18.72,24.12 29.9,24.12 v31.04,22.73
IO14  (via drill 0.25)
  Top 0.254: U7.5 11.44,37.12 14.28,34.16 14.28,26.79 v18.21,23.49 | v30.4,21.84 29.13,20.57 28.69,20.57 IC2.7
  Bottom 0.254: v30.4,21.84 29.01,23.62 v18.21,23.49
LINKRX  (via drill 0.25)
  Top 0.254: IC2.28 22.3,19.55 v21.51,19.55
  Bottom 0.254: v21.51,19.55 21.51,20.06 20.88,20.7 18.47,20.7 16.56,18.79 16.56,15.62 16.31,15.36 12.24,15.36 11.99,15.62 U8.4
LINKTR  (via drill 0.25)
  Top 0.254: v19.74,21.33 20.37,21.33 21.01,20.7 22.03,20.7 IC2.26
  Bottom 0.254: v19.74,21.33 17.83,21.33 17.58,21.71 16.94,21.71 16.43,22.22 16.43,23.87 16.18,24.12 11.27,24.12 R1.1 | U8.3 13.26,18.03 14.66,19.43
  Bottom 0.305: 16.94,21.71 14.66,19.43 14.53,19.3 U8.2
LINKTX  (via drill 0.3)
  Top 0.254: IC2.30 22.78,18.62 v22.78,17.65 | v20.78,19.1 19.86,19.17 18.09,20.95 17.22,20.95 v17.2,20.92
  Bottom 0.254: v22.78,17.65 21.51,17.52 20.5,18.66 v20.78,19.1 | U8.1 15.8,19.65 17.07,20.92 v17.2,20.92
N$1  (via drill 0.3)
  Top 0.406: v7.16,27.05 7.16,30.86 4.5,33.52 4.5,36.32 4.24,36.57 2.19,36.57 J2.P$4
  Bottom 0.254: J3.P$4 45.99,36.19 7.42,36.19 6.91,35.68 6.27,35.68 5.38,36.57 5,36.57 5,36.58 J2.P$4
  Bottom 0.406: v7.16,27.05 7.16,23.36 8.18,22.35 9.23,22.35 R17.2 9.26,21.67 SJ4.1
N$2
  Top 0.61: R21.2 LED2.C
N$3
  Top 0.254: 23.05,6.58 R12.2 23.04,6.6 23.42,6.22 26.25,6.22 C5.2
N$4  (via drill 0.6, 0.61)
  Top 0.254: U2.8 U2.7 | 28.88,9.81 L1.P$2 29.01,9.78
  Top 0.406: U2.7 26.13,12.69 26.85,11.97 26.85,11.3 28.49,9.65 L1.P$2
  Top 0.61: D6.A 21.16,12.03 v21.89,11.3 | v29.01,11.3 29.01,9.78
  Bottom 0.61: v21.89,11.3 v29.01,11.3
N$6  (via drill 0.3)
  Top 0.254: U2.2 24,7.62 24,7.42 v24.56,6.85 | 27.82,6.2 27.86,6.2 C1.2 27.74,6.13 28.05,5.81 28.3,5.81 v28.91,6.41
  Bottom 0.254: v24.56,6.85 28.47,6.85 v28.91,6.41
N$7
  Top 0.406: F1.2 36.7,9.19 38.25,7.64 JP8.VBUS1
N$8
  Top 0.254: U2.12 23.5,13.12 23.42,13.2 23.16,13.2 23.04,13.08 R12.1
N$9
  Top 0.406: F1.1 36.7,14.55 37.64,15.23 39.28,15.23 D1.A
N$10
  Top 0.254: U6.2 43.26,39.9 44.37,41.02 46.35,41.02 48.26,42.92 JP5.1
N$11
  Top 0.254: U6.3 43,40.4 44.25,41.65 44.73,41.65 45.72,42.64 JP5.2
N$12
  Top 0.406: U5.1 44.2,15.76 R19.2
N$13
  Top 0.61: R19.1 LED1.C
N$14
  Top 0.254: U7.2 7.14,38.12 5.64,39.62 4.88,39.62 4.12,40.38 4.12,45.22 JP6.1
N$15
  Top 0.254: U7.3 6.88,37.62 5.38,39.11 3.48,39.11 1.57,41.02 1.57,45.22 JP6.2
N$16  (via drill 0.3, 0.41)
  Top 0.406: v10.97,22.22 v14.53,22.22 14.53,23.74 v13.51,24.76
  Bottom 0.406: SJ3.2 10.19,24.78 v13.51,24.76 | R17.1 10.95,22.24 v10.97,22.22 | v14.53,22.22 U8.7
N$17
  Bottom 0.406: SJ2.1 10.53,17.23 R16.1 10.66,18.03 11.1,18.03 11.28,18.18 11.28,19.83 11.86,20.44 12.5,20.44 13.26,21.2 U8.6
N$18
  Bottom 0.406: R13.2 10.62,9.51 10.62,8.63 10.24,8.25 8.81,8.25 7.92,9.14 7.92,14.98 8.73,15.79 SJ2.2
N$19
  Bottom 0.406: SJ4.2 10.43,19.68 R20.2
N$20
  Bottom 0.406: 9.94,25.43 SJ3.1 9.31,26.06 R14.1
N$21  (via drill 0.3)
  Top 0.406: v6.4,27.81 6.4,29.86 J2.P$3
  Bottom 0.254: J3.P$3 44.85,35.55 7.54,35.55 6.91,34.92 6.15,34.92 5.3,34.08 J2.P$3
  Bottom 0.406: v6.4,27.81 6.4,20.29 7.7,18.99 R20.1 R16.2
N$22
  Top 0.61: R23.2 LED3.C
N$24  (via drill 0.25)
  Top 0.254: R15.1 18.99,9.15 19.36,9.65 v19.74,9.65 | U2.3 24.5,8.62 v24.66,8.45
  Top 0.61: C6.1 R15.1 R18.1
  Bottom 0.254: v19.74,9.65 20.93,8.45 v24.66,8.45
N$25
  Top 0.61: Q1.1 10.91,31.27 U4.1
N$26  (via drill 0.61)
  Top 0.61: v8.94,28.95 8.94,29.59 9.32,29.97 U4.2 11.35,29.97 12.3,29.02 U4.4 | Q1.2 12.84,32.55 v13.39,32
  Bottom 0.61: v8.94,28.95 8.31,28.95 5.77,31.49 5.77,31.58 | v13.39,32 13.64,32.25 13.64,33.25
  Bottom 1.27: J3.P$2 41.14,31.55 39.55,33.14 13.64,33.25 7.8,33.27 6.11,31.58 5.77,31.58 J2.P$2 3.27,31.58 4.88,29.97 4.88,25.84 J1.P$2
N$27
  Top 0.254: R29.2 R27.2 32.6,27.43 29.47,27.43 IC2.14
N$28
  Bottom 0.254: SJ1.2 28.63,16.12 29.92,17.42 U3.GPIO0
N$29
  Top 0.254: IC2.13 29.67,26.92 30.91,26.92 32.31,25.52 R28.2
N$30
  Top 0.254: R27.1 34.23,28.01 37.85,28.01 38.41,28.57 Q3.3
N$31
  Top 0.254: Q3.1 37.45,29.14 37.01,28.7 32.36,28.7 31.85,28.19 29.52,28.19 IC2.15
P0.3/ISP_COMMAND_USB_HIGH
  Top 0.254: R26.1 R25.2 31.88,23.29 31.67,23.49 29.07,23.49 IC2.9
PO1
  Top 0.406: R2.1 16.18,35.3 13.62,37.86 JP4.10
  Bottom 0.203: JP4.10 14.88,39.75 14.88,42.54 14.91,43.89 14.94,46.3 JP7.10
PO2
  Top 0.406: R3.1 18.21,35.3 16.16,37.35 JP4.9
  Bottom 0.203: JP4.9 17.42,39.77 17.4,43.86 17.48,46.32 JP7.9
PO3
  Top 0.406: R4.1 20.24,35.3 18.7,36.84 JP4.8
  Bottom 0.203: 18.7,39.42 19.94,39.75 19.96,42.51 19.94,43.76 20.04,46.3 JP7.8
  Bottom 0.254: JP4.8 18.7,39.42
PO4
  Top 0.406: R5.1 22.28,35.3 21.24,36.34 JP4.7
  Bottom 0.203: JP4.7 22.53,39.77 22.5,41.17 22.53,42.51 22.55,43.89 22.55,45.16 22.61,46.3 JP7.7
PO5
  Top 0.406: R6.1 24.31,35.3 23.78,35.83 JP4.6
  Bottom 0.203: JP4.6 25.04,39.75 25.04,41.19 25.07,42.51 25.04,43.83 25.09,45.21 25.15,46.3 JP7.6
PO6
  Top 0.406: R7.1 26.32,34.27 JP4.5
  Bottom 0.203: JP4.5 27.61,39.77 27.61,45.08 27.69,46.25 JP7.5
PO7
  Top 0.406: R8.1 28.37,35.3 28.86,35.79 JP4.4
  Bottom 0.203: JP4.4 30.12,39.75 30.12,43.81 30.15,45.18 30.23,46.3 JP7.4
PO8
  Top 0.406: R9.1 30.4,35.3 31.4,36.3 JP4.3
  Bottom 0.203: JP4.3 32.66,39.77 32.69,41.19 32.69,42.54 32.72,43.89 32.72,45.26 32.74,46.27 JP7.3
PO9
  Top 0.406: R10.1 32.44,35.3 33.94,36.8 JP4.2
  Bottom 0.203: JP4.2 35.2,39.77 35.2,41.19 35.23,42.51 35.2,44.01 35.2,45.18 35.31,46.25 JP7.2
PO10
  Top 0.203: JP4.1 37.72,39.8 37.74,41.19 37.74,42.46 37.82,43.89 37.82,46.2 JP7.1
  Top 0.406: R11.1 34.47,35.3 36.48,37.31 JP4.1
PROG
  Top 0.406: U5.5 44.18,11.25 R24.1
PROGR  (via drill 0.3)
  Top 0.254: IC2.3 27.23,19.2 v27.23,18.66
  Bottom 0.254: v27.23,18.66 27.23,14.73 26.85,14.35 20.37,14.35 19.74,13.71 15.67,13.71 15.04,13.08 15.04,8.12 16.31,6.85 16.31,5.84 15.8,5.33 14.91,5.33 13.64,6.6 9.07,6.6 7.92,5.46 7.92,3.38 S3.1
PWRSTAT  (via drill 0.3)
  Top 0.254: v23.67,16.63 23.8,16.5 25.7,16.5 25.85,16.36 R30.1 | IC2.27 22.23,20.19 20.75,20.19 v20.37,19.81
  Top 0.61: R30.1 R31.2
  Bottom 0.254: v23.67,16.63 23.42,16.38 21.77,16.38 19.86,18.28 19.86,19.3 v20.37,19.81
USBIN  (via drill 0.3)
  Top 0.254: R25.1 34.3,23.36 34.98,23.36 35.74,22.6 v37.26,22.6 | v37.26,7.11 35.74,8.63 35.74,17.27 36.5,18.03 37.01,18.03 v37.13,18.16 37.26,18.28 | 41.45,8.76 41.45,7.74 v40.82,7.11
  Top 0.406: U5.4 42.28,11.25 C4.2 | LED1.A 45.9,9.27 45.39,8.76 41.45,8.76 41.45,9.14 39.79,10.8 D1.C
  Top 0.61: C4.2 39.81,11.19 D1.C
  Bottom 0.254: v37.26,22.6 37.26,18.28 v37.13,18.16 | v37.26,7.11 v40.82,7.11
USRBTN  (via drill 0.3)
  Top 0.254: R22.2 13.13,11.82 13.13,13.08 13.64,13.58 15.67,13.58 17.2,15.11 v17.2,15.62 | v17.58,22.85 17.07,22.85 16.82,22.6 16.82,21.84 16.43,21.46 16.43,19.43 v17.58,18.28 | IC2.16 26.34,25.71 26.34,25.9 26.26,25.98 v25.88,25.98
  Top 0.61: 12.82,11.59 R22.2 11.86,11.55 11.42,12 BTN.2
  Bottom 0.254: v17.58,18.28 17.7,17.9 17.7,15.87 17.45,15.62 v17.2,15.62 | v17.58,22.85 17.58,24.61 17.86,24.89 21.51,24.89 22.28,25.65 23.19,25.65 23.39,25.45 25.35,25.45 v25.88,25.98
USRLED  (via drill 0.3)
  Top 0.254: IC2.1 26.21,18.8 26.21,18.41 26.09,18.28 v25.32,18.28 | LED3.A 19.48,16.25 20.24,15.74 v22.15,15.74
  Bottom 0.254: v22.15,15.74 24.82,15.74 25.32,16.25 v25.32,18.28
VCC  (via drill 0.41, 0.46, 0.61)
  Top 0.254: U2.11 U2.10 24.25,12.75 | 28.24,13.58 L1.P$1 | v25.96,13.58 24.55,15 R30.2
  Top 0.406: C3.2 16.07,11.82 v14.28,10.03
  Top 0.457: 24.25,12.75 v24.05,13.58 | v25.96,13.58 28.24,13.58 | U5.3 42.28,19.74 41.2,20.82
  Top 0.61: 29.39,12.44 31.29,10.53 31.29,8.5 30.66,7.87 29.12,7.87 | 29.39,12.44 L1.P$1 33.71,12.94 35.05,14.28 35.05,14.4 35.08,17.42 35.08,18.13 35.99,19.04 38.41,19.04 39.17,19.81 C12.1 40.2,21.19 40.56,20.82 41.2,20.82 43.05,20.82 J4.2 | 29.77,12.82 29.39,12.44 | U4.3 10.3,28.99 v11.35,27.93 11.35,26.28 10.85,25.78 7.8,25.78 6.4,24.38 6.4,14.85 4.75,13.2 v4.75,11.04 | v9.2,30.98 9.2,34.03 9.96,34.79 11.82,34.79 Q1.3 | 29.12,7.87 v29.03,7.97 | 29.12,7.87 29.12,7.75 | v14.91,6.73 v18.21,6.73
  Bottom 0.406: v14.28,10.03 14.28,7.36
  Bottom 0.457: v24.05,13.58 v25.96,13.58
  Bottom 0.61: v9.2,30.98 10.72,30.98 11.1,30.35 11.1,28.19 v11.35,27.93 | v4.75,11.04 4.75,9.01 6.4,7.36 14.28,7.36 v14.91,6.73 | v29.03,7.97 28.98,7.67 19.55,7.67 18.61,6.73 v18.21,6.73
VCCIO  (via drill 0.3)
  Top 0.254: U7.1 8.8,38.62 8.31,39.11 v8.31,39.62 | C21.2 39.61,36.51 40.06,36.06 42.34,36.06 43.36,37.08 v43.36,38.98 42.94,39.4 U6.1
  Top 0.61: JP1.10 13.31,41.02 12.45,41.02 12.1,40.66 C22.2
  Top 1.372: JP1.1 JP1.2 JP1.3 JP1.4 JP1.5 JP1.6 JP1.7 JP1.8 JP1.9 JP1.10
  Bottom 0.254: v8.31,39.62 12.17,39.62 JP1.10 | 26.06,2.28 26.06,1.3 S1.4
  Bottom 1.27: 26.06,2.28 48.31,2.28 48.97,2.94 48.97,37.48 47.47,38.98 v43.36,38.98 39.4,38.96 JP1.1 | S1.4 S1.1
VNEG  (via drill 0.6)
  Top 0.254: U2.5 25.5,9.77 25.58,9.77 25.58,10.18 U2.6
  Top 0.61: C3.1 17.32,10.52 C7.1 16.31,10.15 v16.31,10.66 | v26.21,9.14 25.83,9.65 25.83,10.14 25.96,10.14 U2.6
  Bottom 0.406: GND5.P$1 16.84,12.82 GND6.P$1
  Bottom 0.61: v16.31,10.66 16.69,11.04 | 16.69,11.04 19.74,11.04 21.51,9.27 25.83,9.27 v26.21,9.14 | 16.69,11.04 16.54,11.2 GND6.P$1
WIFIRX  (via drill 0.25)
  Top 0.254: IC2.32 24.18,18.6 24.18,18.16 24.69,17.65 v28.37,17.65 | v36.88,17.27 40.31,17.27 v40.44,17.39
  Bottom 0.254: v28.37,17.65 29.64,18.92 33.58,18.92 35.23,17.27 v36.88,17.27 | v40.44,17.39 40.44,12.44 41.46,11.42 U3.URXD
WIFITX  (via drill 0.25, 0.3)
  Top 0.254: IC2.31 23.67,18.8 23.67,17.9 24.56,17.01 v27.86,17.01 | v36.37,16.63 v41.2,16.63
  Bottom 0.254: v27.86,17.01 28.63,17.01 30.02,18.41 33.33,18.41 35.23,16.63 v36.37,16.63 | v41.2,16.63 41.58,16.25 41.58,14.22 42.38,13.42 U3.UTXD
XTALIN
  Top 0.254: C17.1 30.98,16.17 Q2.3 30.36,16.77 IC2.4
XTALOUT
  Top 0.254: Q2.1 32.93,18.67 32.94,19.55 32.94,19.92 C18.1 31.29,20.95 29.52,19.17 28.68,19.17 IC2.5

### Text on the board
tPlace: LNK | LNK | PWR | BOOST | USR | LiPo | v0.2 | CHR | PRG | Y | X
bPlace: (8.5;45) | (41;45) | (16;3) | Y | X
bNames: T2 | T3 | MUNDO READER S.L. 2015 | T1 | ALVARO FERRAN / PIGHIXXX